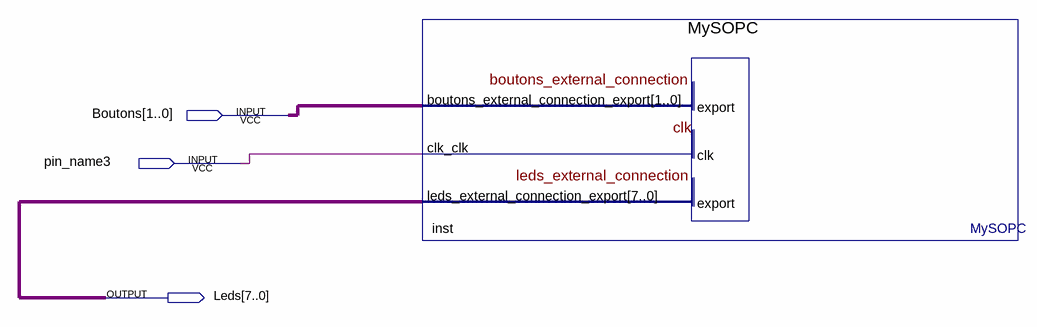
[diagram p0: schematic sheet]
// Quartus schematic MySOPC.bdf as structural Verilog: 1 symbols, 3 pins
module MySOPC (
  input  [1:0] Boutons,
  input  pin_name3,
  output [7:0] Leds
);

  MySOPC inst (
    .boutons_external_connection_export(Boutons), .clk_clk(pin_name3), .leds_external_connection_export(Leds));
endmodule
